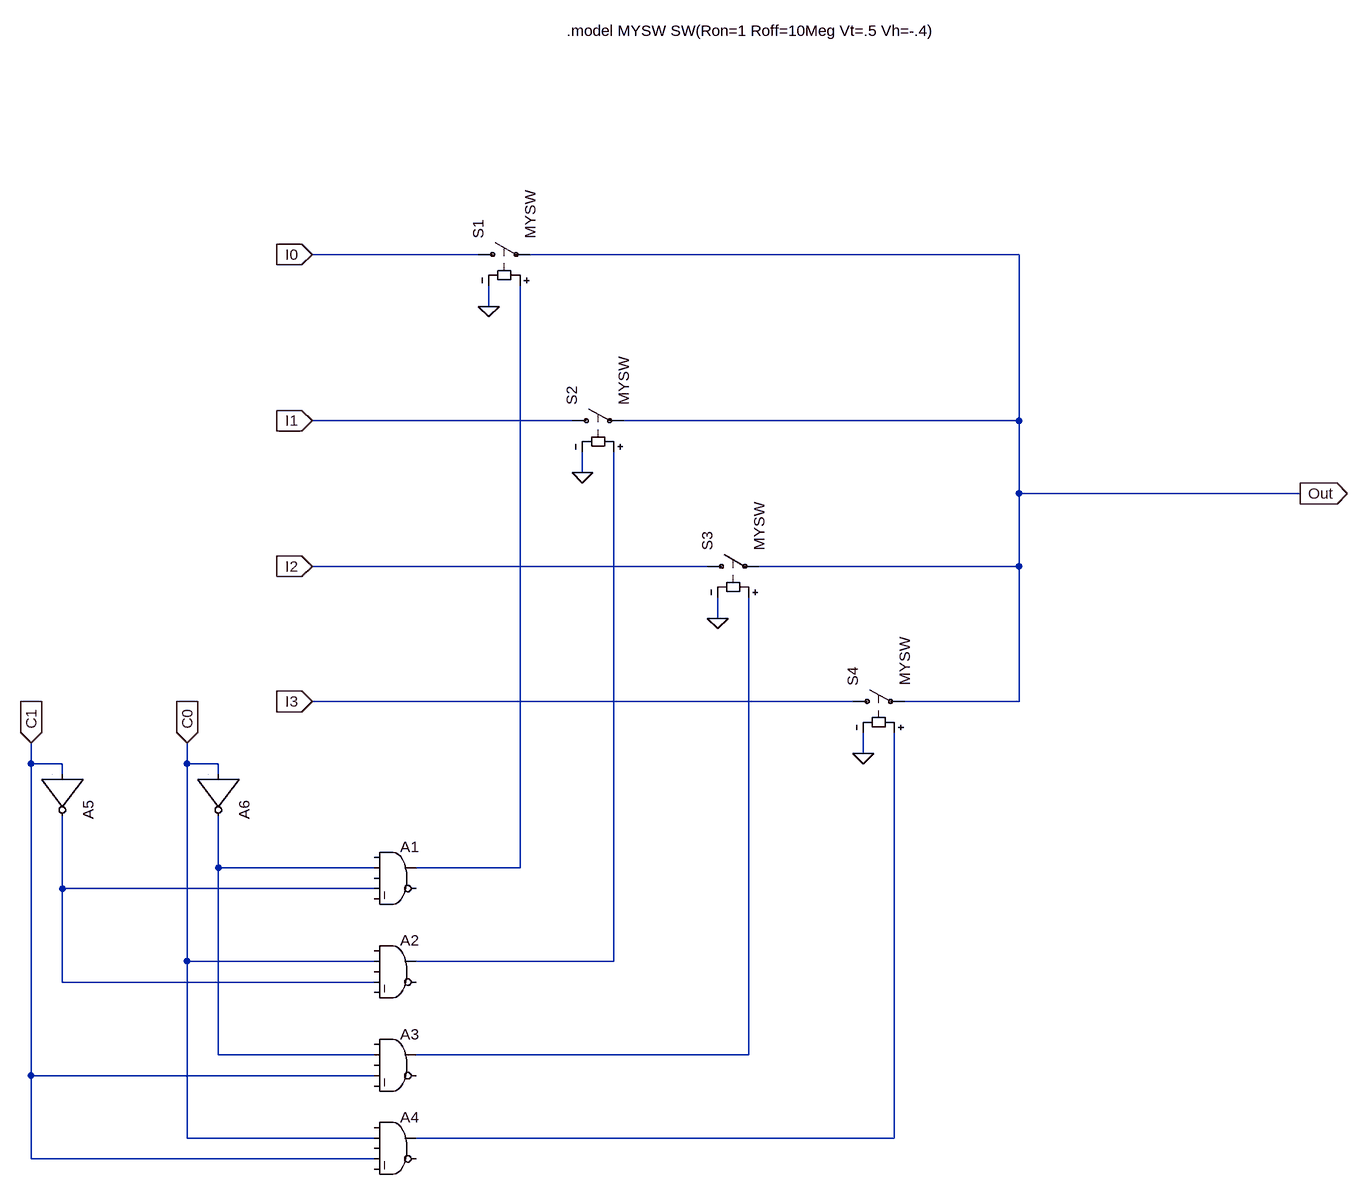
[diagram p0: schematic AnalogMux.asc]
AnalogMux.asc, the LTspice schematic file:
Version 4
SHEET 1 1540 1496
WIRE 176 16 -80 16
WIRE 1008 16 256 16
WIRE 192 96 192 64
WIRE 320 272 -80 272
WIRE 1008 272 1008 16
WIRE 1008 272 400 272
WIRE 336 352 336 320
WIRE 1008 384 1008 272
WIRE 1440 384 1008 384
WIRE 528 496 -80 496
WIRE 1008 496 1008 384
WIRE 1008 496 608 496
WIRE 544 576 544 544
WIRE 752 704 -80 704
WIRE 1008 704 1008 496
WIRE 1008 704 832 704
WIRE 768 784 768 752
WIRE -512 800 -512 768
WIRE -464 800 -512 800
WIRE -272 800 -272 768
WIRE -224 800 -272 800
WIRE -464 816 -464 800
WIRE -224 816 -224 800
WIRE -224 960 -224 880
WIRE 16 960 -224 960
WIRE 240 960 240 64
WIRE 240 960 80 960
WIRE -464 992 -464 880
WIRE 16 992 -464 992
WIRE -272 1104 -272 800
WIRE 16 1104 -272 1104
WIRE 384 1104 384 320
WIRE 384 1104 80 1104
WIRE -464 1136 -464 992
WIRE 16 1136 -464 1136
WIRE -224 1248 -224 960
WIRE 16 1248 -224 1248
WIRE 592 1248 592 544
WIRE 592 1248 80 1248
WIRE -512 1280 -512 800
WIRE 16 1280 -512 1280
WIRE -272 1376 -272 1104
WIRE 16 1376 -272 1376
WIRE 816 1376 816 752
WIRE 816 1376 80 1376
WIRE -512 1408 -512 1280
WIRE 16 1408 -512 1408
FLAG 336 352 0
FLAG 544 576 0
FLAG 768 784 0
FLAG -512 768 C1
IOPIN -512 768 In
FLAG -272 768 C0
IOPIN -272 768 In
FLAG -80 16 I0
IOPIN -80 16 In
FLAG -80 272 I1
IOPIN -80 272 In
FLAG -80 496 I2
IOPIN -80 496 In
FLAG -80 704 I3
IOPIN -80 704 In
FLAG 1440 384 Out
IOPIN 1440 384 Out
FLAG 192 96 0
SYMBOL sw 160 16 R270
SYMATTR InstName S1
SYMATTR Value MYSW
SYMBOL sw 304 272 R270
SYMATTR InstName S2
SYMATTR Value MYSW
SYMBOL sw 512 496 R270
SYMATTR InstName S3
SYMATTR Value MYSW
SYMBOL sw 736 704 R270
SYMATTR InstName S4
SYMATTR Value MYSW
SYMBOL Digital\\and 48 912 R0
SYMATTR InstName A1
SYMBOL Digital\\and 48 1056 R0
SYMATTR InstName A2
SYMBOL Digital\\and 48 1200 R0
SYMATTR InstName A3
SYMBOL Digital\\and 48 1328 R0
SYMATTR InstName A4
SYMBOL Digital\\inv -400 816 R90
SYMATTR InstName A5
SYMBOL Digital\\inv -160 816 R90
SYMATTR InstName A6
TEXT 312 -328 Left 2 !.model MYSW SW(Ron=1 Roff=10Meg Vt=.5 Vh=-.4)

The netlist it stands for:
* AnalogMux.asc
S1 I0 Out N002 0 MYSW
S2 I1 Out N004 0 MYSW
S3 I2 Out N005 0 MYSW
S4 I3 Out N006 0 MYSW
A1 0 N001 0 N003 0 0 N002 0 AND
A2 0 C0 0 N003 0 0 N004 0 AND
A3 0 N001 0 C1 0 0 N005 0 AND
A4 0 C0 0 C1 0 0 N006 0 AND
A5 C1 0 0 0 0 N003 0 0 BUF
A6 C0 0 0 0 0 N001 0 0 BUF
.model MYSW SW(Ron=1 Roff=10Meg Vt=.5 Vh=-.4)
.backanno
.end